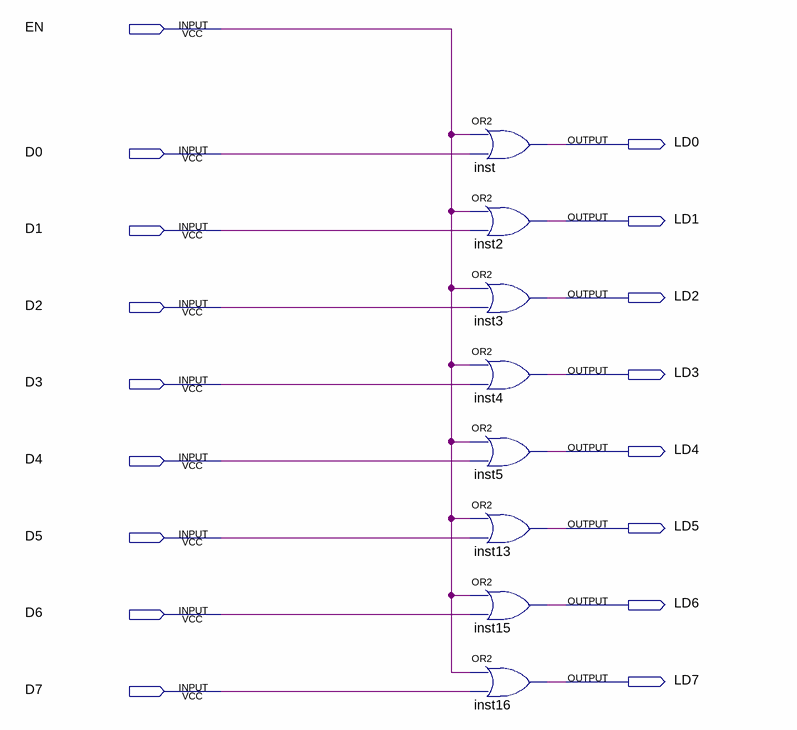
[diagram p0: schematic sheet]
// Quartus schematic 8bufer0.bdf as structural Verilog: 8 symbols, 17 pins
module \8bufer0  (
  input  EN,
  input  D0,
  input  D1,
  input  D2,
  input  D3,
  input  D4,
  input  D5,
  input  D6,
  input  D7,
  output LD0,
  output LD1,
  output LD2,
  output LD3,
  output LD4,
  output LD5,
  output LD6,
  output LD7
);

  or inst (LD0, EN, D0);
  or inst2 (LD1, EN, D1);
  or inst3 (LD2, EN, D2);
  or inst4 (LD3, EN, D3);
  or inst5 (LD4, EN, D4);
  or inst13 (LD5, EN, D5);
  or inst15 (LD6, EN, D6);
  or inst16 (LD7, EN, D7);
endmodule
